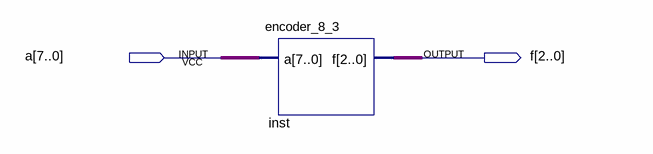
[diagram p0: schematic sheet]
// Quartus schematic Block1.bdf as structural Verilog: 1 symbols, 2 pins
module Block1 (
  input  [7:0] a,
  output [2:0] f
);

  encoder_8_3 inst (.a(a), .f(f));
endmodule
